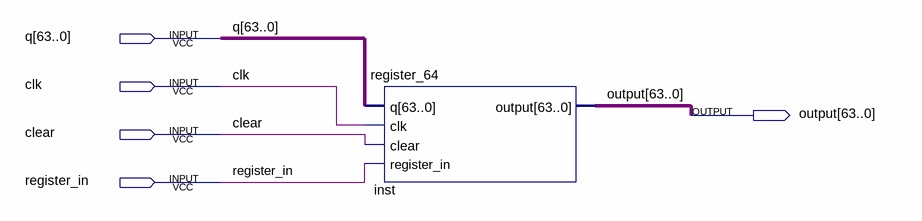
[diagram p0: schematic sheet]
// Quartus schematic register_64_test.bdf as structural Verilog: 1 symbols, 5 pins
module register_64_test (
  input  [63:0] q,
  input  clk,
  input  clear,
  input  register_in,
  output [63:0] \output 
);

  register_64 inst (.q(q), .clk(clk), .clear(clear), .register_in(register_in), .\output (\output ));
endmodule
